# EAGLE design PiKVM_ATX_Adapter v1.5 (EAGLE 9.6.2)
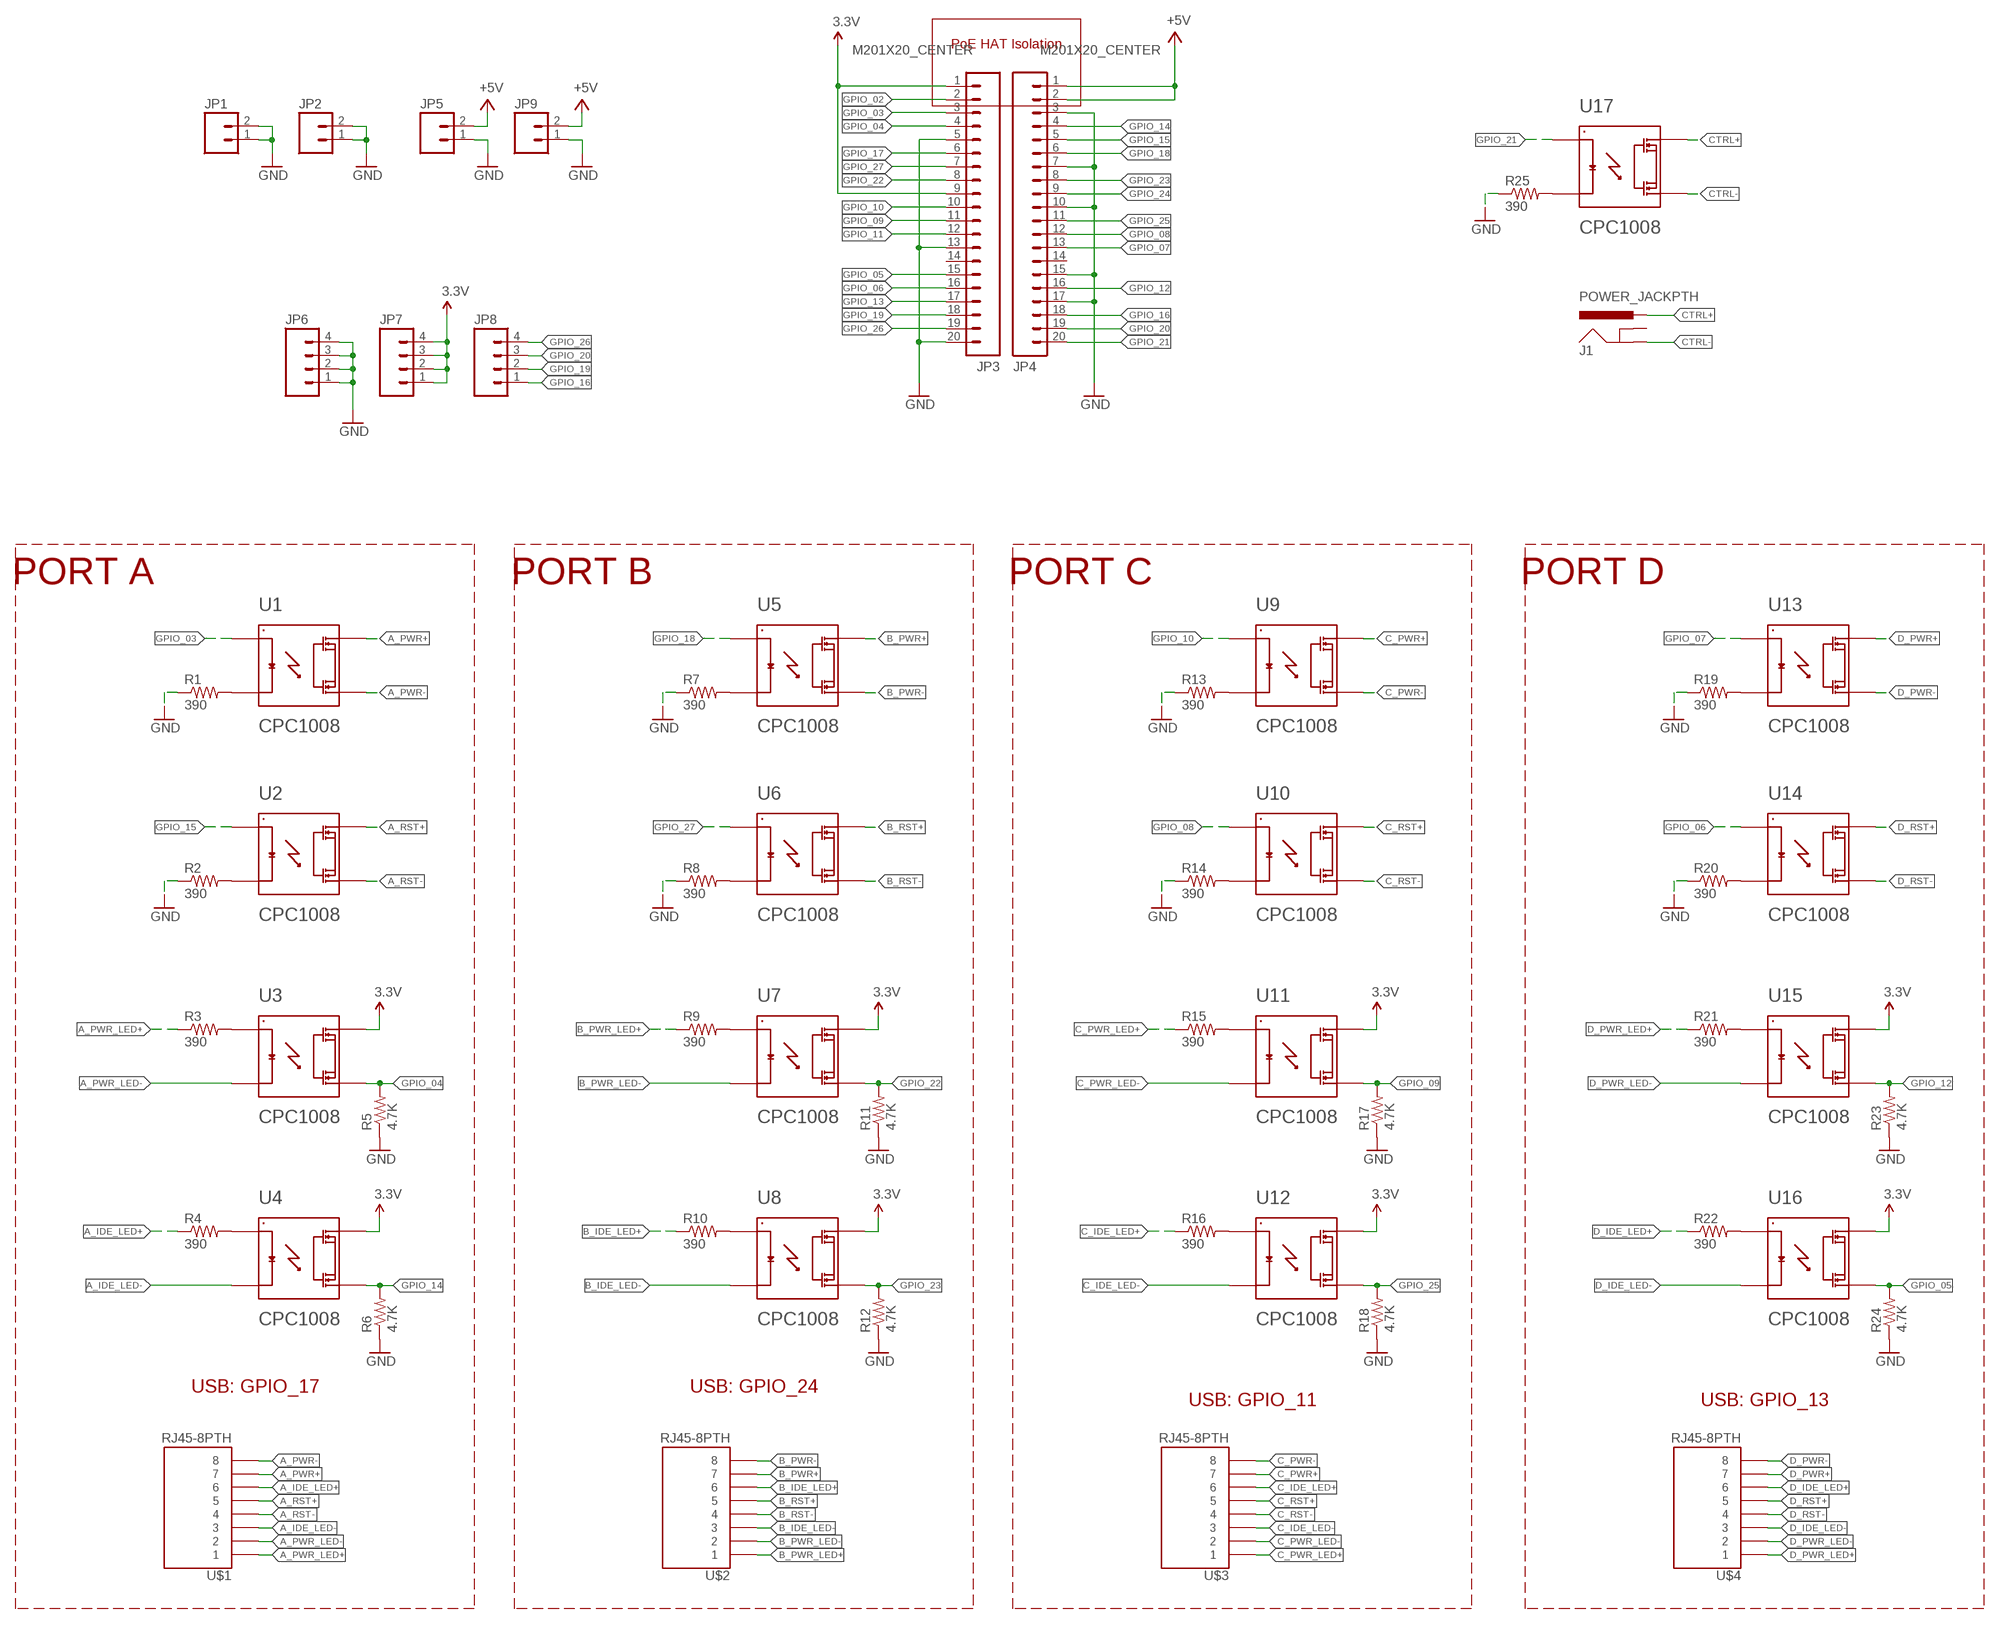
[diagram p0: schematic, sheet 1]

## Parts
J1  POWER_JACKPTH  [POWER_JACK_PTH]
JP1  M02LOCK  [1X02_LOCK]
JP2  M02LOCK  [1X02_LOCK]
JP3  M201X20_CENTER  [1X20_CENTER]
JP4  M201X20_CENTER  [1X20_CENTER]
JP5  M02LOCK  [1X02_LOCK]
JP6  M04PTH  [1X04]
JP7  M04PTH  [1X04]
JP8  M04PTH  [1X04]
JP9  M02LOCK  [1X02_LOCK]
R1  390  RESISTOR1206  [1206]
R2  390  RESISTOR1206  [1206]
R3  390  RESISTOR1206  [1206]
R4  390  RESISTOR1206  [1206]
R5  4.7K  RESISTOR1206  [1206]
R6  4.7K  RESISTOR1206  [1206]
R7  390  RESISTOR1206  [1206]
R8  390  RESISTOR1206  [1206]
R9  390  RESISTOR1206  [1206]
R10  390  RESISTOR1206  [1206]
R11  4.7K  RESISTOR1206  [1206]
R12  4.7K  RESISTOR1206  [1206]
R13  390  RESISTOR1206  [1206]
R14  390  RESISTOR1206  [1206]
R15  390  RESISTOR1206  [1206]
R16  390  RESISTOR1206  [1206]
R17  4.7K  RESISTOR1206  [1206]
R18  4.7K  RESISTOR1206  [1206]
R19  390  RESISTOR1206  [1206]
R20  390  RESISTOR1206  [1206]
R21  390  RESISTOR1206  [1206]
R22  390  RESISTOR1206  [1206]
R23  4.7K  RESISTOR1206  [1206]
R24  4.7K  RESISTOR1206  [1206]
R25  390  RESISTOR1206  [1206]
U1  CPC1008  [SOP-4]
U2  CPC1008  [SOP-4]
U3  CPC1008  [SOP-4]
U4  CPC1008  [SOP-4]
U5  CPC1008  [SOP-4]
U6  CPC1008  [SOP-4]
U7  CPC1008  [SOP-4]
U8  CPC1008  [SOP-4]
U9  CPC1008  [SOP-4]
U10  CPC1008  [SOP-4]
U11  CPC1008  [SOP-4]
U12  CPC1008  [SOP-4]
U13  CPC1008  [SOP-4]
U14  CPC1008  [SOP-4]
U15  CPC1008  [SOP-4]
U16  CPC1008  [SOP-4]
U17  CPC1008  [SOP-4]
U$1  RJ45-8PTH  [RJ45-8]
U$2  RJ45-8PTH  [RJ45-8]
U$3  RJ45-8PTH  [RJ45-8]
U$4  RJ45-8PTH  [RJ45-8]

## Nets
3.3V: JP3.1 JP3.9 JP7.1 JP7.2 JP7.3 JP7.4 U3.P$4 U4.P$4 U7.P$4 U8.P$4 U11.P$4 U12.P$4 U15.P$4 U16.P$4
+5V: JP4.1 JP4.2 JP5.2 JP9.2
A_IDE_LED+: R4.1 U$1.6
A_IDE_LED-: U4.P$2 U$1.3
A_PWR+: U1.P$4 U$1.7
A_PWR-: U1.P$3 U$1.8
A_PWR_LED+: R3.1 U$1.1
A_PWR_LED-: U3.P$2 U$1.2
A_RST+: U2.P$4 U$1.5
A_RST-: U2.P$3 U$1.4
B_IDE_LED+: R10.1 U$2.6
B_IDE_LED-: U8.P$2 U$2.3
B_PWR+: U5.P$4 U$2.7
B_PWR-: U5.P$3 U$2.8
B_PWR_LED+: R9.1 U$2.1
B_PWR_LED-: U7.P$2 U$2.2
B_RST+: U6.P$4 U$2.5
B_RST-: U6.P$3 U$2.4
C_IDE_LED+: R16.1 U$3.6
C_IDE_LED-: U12.P$2 U$3.3
C_PWR+: U9.P$4 U$3.7
C_PWR-: U9.P$3 U$3.8
C_PWR_LED+: R15.1 U$3.1
C_PWR_LED-: U11.P$2 U$3.2
C_RST+: U10.P$4 U$3.5
C_RST-: U10.P$3 U$3.4
CTRL+: J1.PWR U17.P$4
CTRL-: J1.GND U17.P$3
D_IDE_LED+: R22.1 U$4.6
D_IDE_LED-: U16.P$2 U$4.3
D_PWR+: U13.P$4 U$4.7
D_PWR-: U13.P$3 U$4.8
D_PWR_LED+: R21.1 U$4.1
D_PWR_LED-: U15.P$2 U$4.2
D_RST+: U14.P$4 U$4.5
D_RST-: U14.P$3 U$4.4
GND: JP1.1 JP1.2 JP2.1 JP2.2 JP3.5 JP3.13 JP3.20 JP4.3 JP4.7 JP4.10 JP4.15 JP4.17 JP5.1 JP6.1 JP6.2 JP6.3 JP6.4 JP9.1 R1.1 R2.1 R5.1 R6.1 R7.1 R8.1 R11.1 R12.1 R13.1 R14.1 R17.1 R18.1 R19.1 R20.1 R23.1 R24.1 R25.1
GPIO_02: JP3.2
GPIO_03: JP3.3 U1.P$1
GPIO_04: JP3.4 R5.2 U3.P$3
GPIO_05: JP3.15 R24.2 U16.P$3
GPIO_06: JP3.16 U14.P$1
GPIO_07: JP4.13 U13.P$1
GPIO_08: JP4.12 U10.P$1
GPIO_09: JP3.11 R17.2 U11.P$3
GPIO_10: JP3.10 U9.P$1
GPIO_11: JP3.12
GPIO_12: JP4.16 R23.2 U15.P$3
GPIO_13: JP3.17
GPIO_14: JP4.4 R6.2 U4.P$3
GPIO_15: JP4.5 U2.P$1
GPIO_16: JP4.18 JP8.1
GPIO_17: JP3.6
GPIO_18: JP4.6 U5.P$1
GPIO_19: JP3.18 JP8.2
GPIO_20: JP4.19 JP8.3
GPIO_21: JP4.20 U17.P$1
GPIO_22: JP3.8 R11.2 U7.P$3
GPIO_23: JP4.8 R12.2 U8.P$3
GPIO_24: JP4.9
GPIO_25: JP4.11 R18.2 U12.P$3
GPIO_26: JP3.19 JP8.4
GPIO_27: JP3.7 U6.P$1
N$1: R2.2 U2.P$2
N$2: R3.2 U3.P$1
N$3: R7.2 U5.P$2
N$4: R1.2 U1.P$2
N$5: R4.2 U4.P$1
N$6: R8.2 U6.P$2
N$7: R9.2 U7.P$1
N$8: R10.2 U8.P$1
N$9: R13.2 U9.P$2
N$10: R14.2 U10.P$2
N$11: R15.2 U11.P$1
N$12: R16.2 U12.P$1
N$13: R19.2 U13.P$2
N$14: R20.2 U14.P$2
N$15: R21.2 U15.P$1
N$16: R22.2 U16.P$1
N$17: R25.2 U17.P$2
Unconnected: J1.GNDBREAK JP3.14 JP4.14

## Notes on the sheet
- PoE HAT Isolation
- PORT A | PORT B | PORT C | PORT D
- USB: GPIO_17 | USB: GPIO_24
- USB: GPIO_11 | USB: GPIO_13

## Library data of the parts
J1 = SparkFun-Connectors:POWER_JACK: Power Jack This is the standard 5.5mm barrel jack for power. The PTH is the most common, proven, reliable, footprint. The Slot footprint only works if the mill layer is transmitted to the PCB fab house so be warned. Spark Fun Electronics SKU : PRT-00119 SMT: CONN-08106 Mating wall wart : TOL-00298 (and others)
JP1 JP2 JP5 JP9 = SparkFun-Connectors:M02: Header 2 Standard 2-pin 0.1" header. Use with straight break away headers (SKU : PRT-00116), right angle break away headers (PRT-00553), swiss pins (PRT-00743), machine pins (PRT-00117), and female headers (PRT-00115). Molex polarized connector foot print use with SKU : PRT-08233 with associated crimp pins and housings.
JP3 JP4 = SparkFun-Connectors:M20: 1x20 .1" header This is just like the LOCK variant in that the holes are staggared by 5 mil, but except for the last two holes. They are not altered from the "standard" footprint layout. This is used for a special purpose on the layout of our Graphic LCD Backpack. Make sure you want to use this device before selecting it for you project!
JP6-JP8 = SparkFun-Connectors:M04: Header 4 Standard 4-pin 0.1" header. Use with straight break away headers (SKU : PRT-00116), right angle break away headers (PRT-00553), swiss pins (PRT-00743), machine pins (PRT-00117), and female headers (PRT-00115). Molex polarized connector foot print use with SKU : PRT-08231 with associated crimp pins and housings. 1MM SMD Version SKU: PRT-10208
R1-R25 = SparkFun-Resistors:RESISTOR: Resistor Basic schematic elements and footprints for 0603, 1206, and PTH resistors.
U1-U17 = MyLib2:CPC1008
U$1-U$4 = SparkFun-Connectors:RJ45-8: RJ45 Jack Simple RJ45, 8-pin connection - connector for common Cat5, Cat5e, and Cat6 Ethernet cables. Footprint not yet proven in production. Connector sku is PRT-00643; Breakout PCB sku is BOB-00716.

## Board
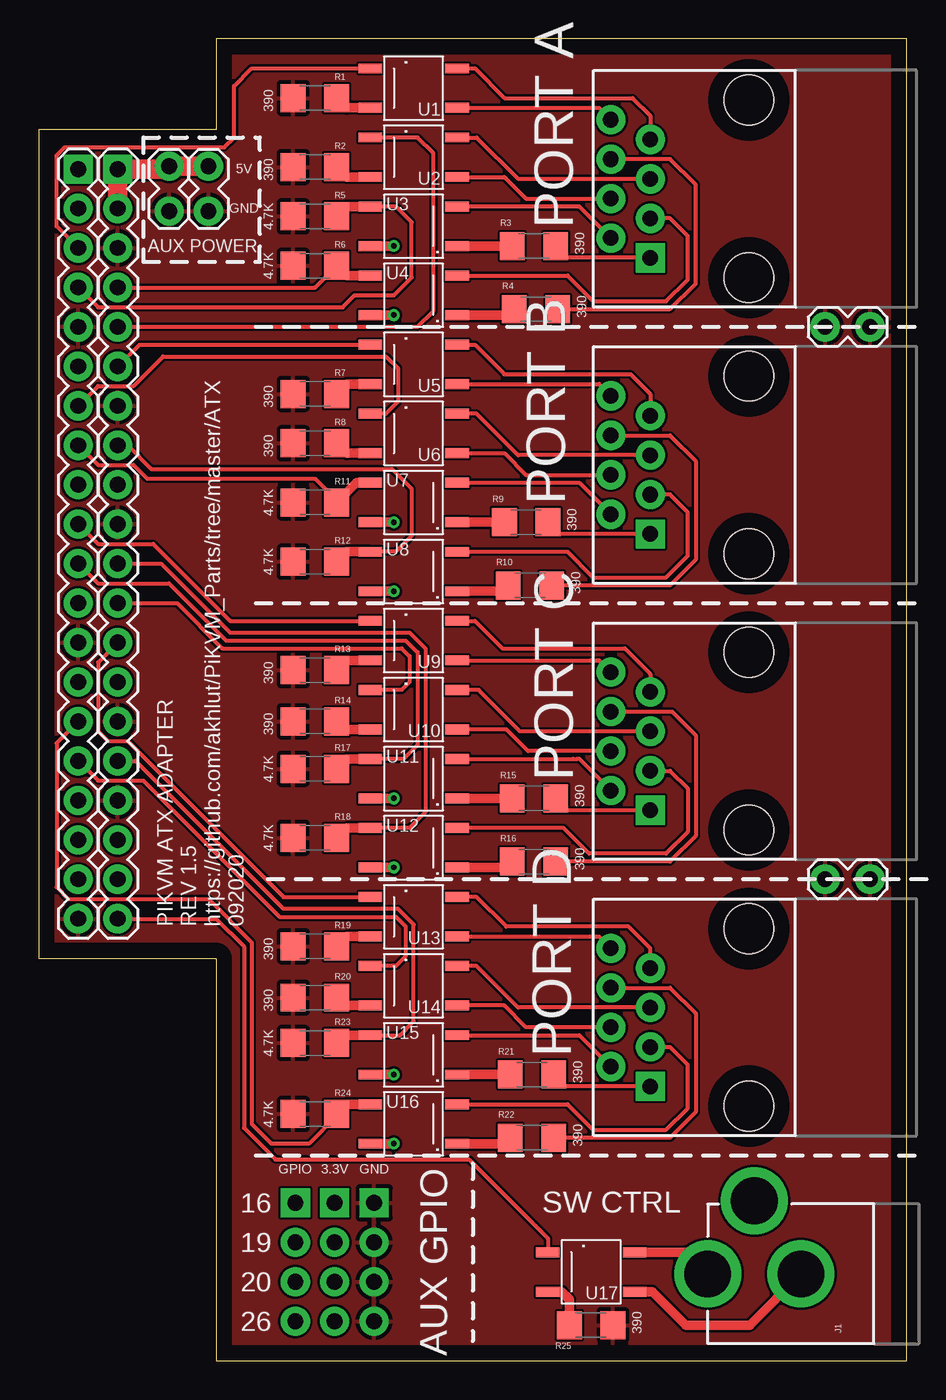
[diagram p1: board, top side]
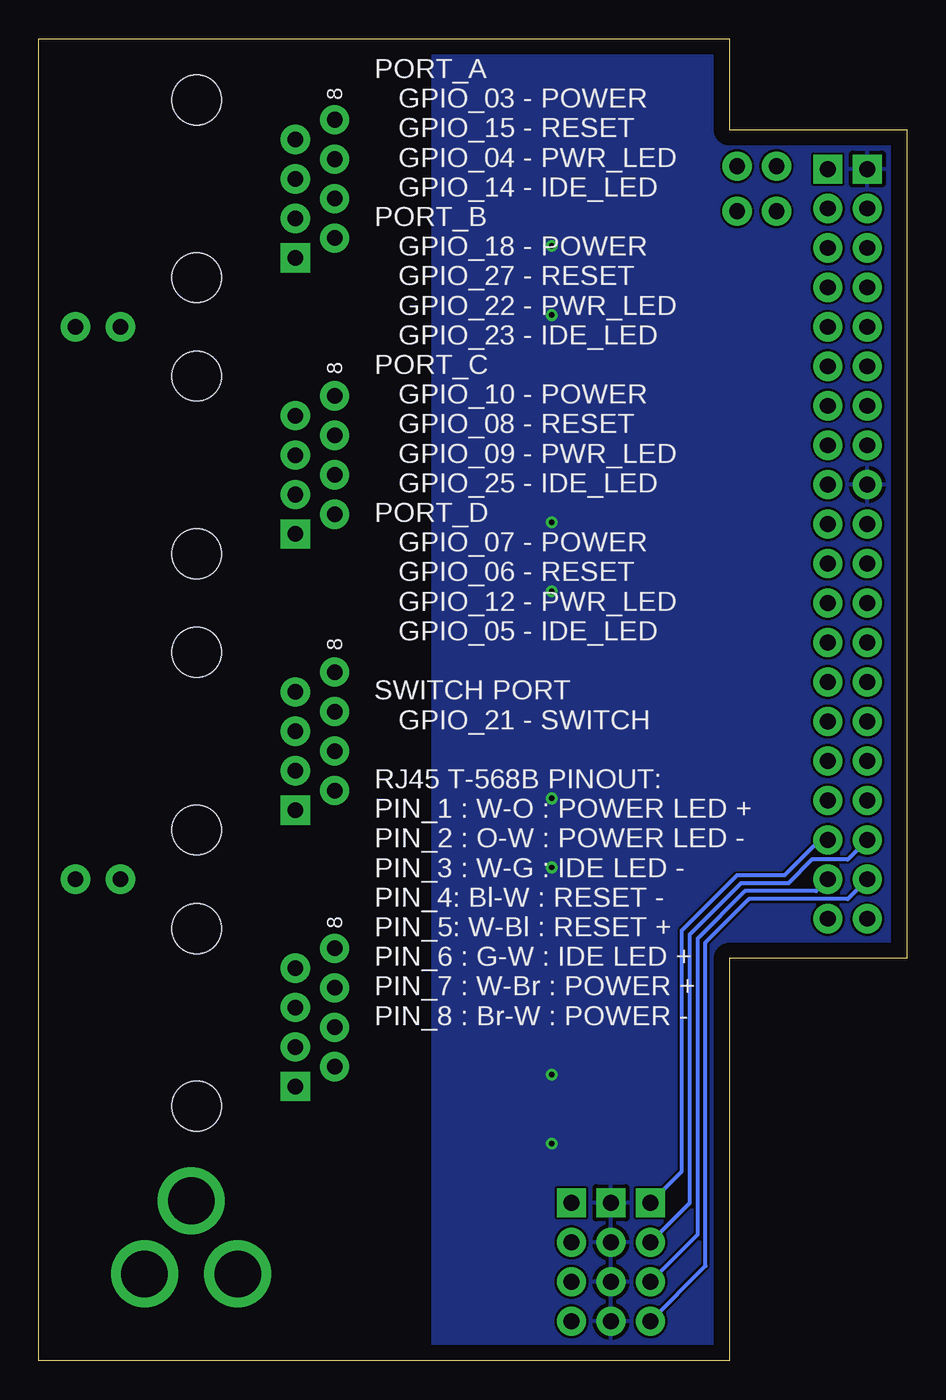
[diagram p2: board, bottom side, seen from below]

Size 55.88 x 85.09 mm. Coordinates in mm from the lower left corner, seen from the top.
Outline: 11.43,0 55.88,0 55.88,85.09 11.43,85.09 11.43,79.25 0,79.25 0,25.91 11.43,25.91 11.43,0
Copper layers (1*16): Top 0.035mm / dielectric 1.5mm / Bottom 0.035mm
Design rules "default": minimum track width 6mil, minimum drill 0.35mm, track to track 6mil, track to pad 6mil, pad to pad 6mil, via to via 6mil, smd to smd 6mil, copper to edge 40mil, drill to drill 6mil, minimum pad ring 10mil, minimum via ring 8mil, stop-mask expansion 4mil, vias tented up to drill 0mil, thermal gap 10mil

### Footprints (pad centres in the part's own frame; a part is rotated, then mirrored left to right if it is on the bottom)
POWER_JACK_PTH = drill 2.997 pad 4.318: GND 0,7.7; GNDBREAK 4.7,10.7; PWR 0,13.7
1X02_LOCK = drill 1.016 pad 1.88: 1 -0.178,0; 2 2.718,0
1X20_CENTER = drill 1.016 pad 1.88 square: 1 -24.13,0 | drill 1.016 pad 1.88: 2 -21.59,0; 3 -19.05,0; 4 -16.51,0; 5 -13.97,0; 6 -11.43,0; 7 -8.89,0; 8 -6.35,0; 9 -3.81,0; 10 -1.27,0; 11 1.27,0; 12 3.81,0; 13 6.35,0; 14 8.89,0; 15 11.43,0; 16 13.97,0; 17 16.51,0; 18 19.05,0; 19 21.59,0; 20 24.13,0
1X04 = drill 1.016 pad 1.88 square: 1 -3.81,0 | drill 1.016 pad 1.88: 2 -1.27,0; 3 1.27,0; 4 3.81,0
1206 = smd 1.6 x 1.8: 1 -1.4,0; 2 1.4,0
SOP-4 = smd 0.635 x 1.524: P$1 -1.27,-2.794; P$2 1.27,-2.794; P$3 1.27,2.794; P$4 -1.27,2.794
RJ45-8 = drill 1 pad 1.88 square: 1 -4.445,6.35 | drill 1 pad 1.88: 2 -3.175,8.89; 3 -1.905,6.35; 4 -0.635,8.89; 5 0.635,6.35; 6 1.905,8.89; 7 3.175,6.35; 8 4.445,8.89 | hole 3.2: -5.715,0; 5.715,0

### Placement (x,y rotation side)
J1  56.77,5.59 90 top
JP1  50.8,66.55 0 top
JP2  50.8,30.99 0 top
JP3  2.54,52.58 270 top
JP4  5.08,52.58 270 top
JP5  8.38,74.17 90 top
JP6  21.59,6.35 270 top
JP7  19.05,6.35 270 top
JP8  16.51,6.35 270 top
JP9  10.92,74.17 90 top
R1  17.78,81.28 0 top
R2  17.78,76.83 0 top
R3  31.88,71.75 180 top
R4  32,67.69 180 top
R5  17.78,73.66 0 top
R6  17.78,70.48 0 top
R7  17.78,62.23 0 top
R8  17.78,59.05 0 top
R9  31.37,53.98 180 top
R10  31.62,49.91 180 top
R11  17.78,55.24 0 top
R12  17.78,51.44 0 top
R13  17.78,44.45 0 top
R14  17.78,41.15 0 top
R15  31.88,36.2 180 top
R16  31.88,32.13 180 top
R17  17.78,38.1 0 top
R18  17.78,33.66 0 top
R19  17.78,26.67 0 top
R20  17.78,23.37 0 top
R21  31.75,18.41 180 top
R22  31.75,14.35 180 top
R23  17.78,20.45 0 top
R24  17.78,15.88 0 top
R25  35.56,2.29 180 top
U1  24.13,81.92 270 top
U2  24.13,77.47 270 top
U3  24.13,73.03 90 top
U4  24.13,68.58 90 top
U5  24.13,64.14 270 top
U6  24.13,59.69 270 top
U7  24.13,55.24 90 top
U8  24.13,50.8 90 top
U9  24.13,46.35 270 top
U10  24.13,41.91 270 top
U11  24.13,37.47 90 top
U12  24.13,33.02 90 top
U13  24.13,28.57 270 top
U14  24.13,24.13 270 top
U15  24.13,19.68 90 top
U16  24.13,15.24 90 top
U17  35.56,5.71 270 top
U$1  45.72,75.44 90 top
U$2  45.72,57.66 90 top
U$3  45.72,39.88 90 top
U$4  45.72,22.1 90 top

### Tracks (layer width: path | path; a pad name or v marks a point on that pad's centre or on a via)
3.3V  (via drill 0.35)
  Top 0.61: U15.P$4 v22.86,18.41 | U16.P$4 v22.86,13.97 | U12.P$4 v22.86,31.75 | U11.P$4 v22.86,36.2 | U8.P$4 v22.86,49.53 | U7.P$4 v22.86,53.98 | U4.P$4 v22.86,67.31 | U3.P$4 v22.86,71.75
  pour Bottom: 0,85.09 0,0 30.48,0 30.48,85.09
+5V
  Top 1.27: JP9.2 JP5.2 8.2,76.71 JP4.1 JP4.2
A_IDE_LED+
  Top 0.254: U$1.6 40.64,77.34 42.29,75.69 42.29,69.34 40.64,67.69 R4.1
A_IDE_LED-
  Top 0.254: U4.P$2 34.04,69.85 35.69,68.2 40.39,68.2 41.78,69.6 41.78,72.39 40.64,73.53 U$1.3
A_PWR+
  Top 0.254: U1.P$4 28.07,83.19 29.97,81.28 38.23,81.28 39.37,80.14 U$1.7
A_PWR-
  Top 0.254: U1.P$3 36.07,80.64 U$1.8
A_PWR_LED+
  Top 0.254: R3.1 34.04,70.99 U$1.1
A_PWR_LED-
  Top 0.254: U$1.2 34.8,74.3 U3.P$2
A_RST+
  Top 0.254: U2.P$4 28.19,78.74 30.86,76.07 U$1.5
A_RST-
  Top 0.254: U2.P$3 29.97,76.2 31.37,74.8 U$1.4
B_IDE_LED+
  Top 0.254: R10.1 40.64,49.91 42.29,51.56 42.29,57.91 40.64,59.56 U$2.6
B_IDE_LED-
  Top 0.254: U8.P$2 34.04,52.07 35.69,50.42 40.39,50.42 41.78,51.82 41.78,54.61 40.64,55.75 U$2.3
B_PWR+
  Top 0.254: U5.P$4 28.07,65.41 29.97,63.5 38.1,63.5 39.37,62.23 U$2.7
B_PWR-
  Top 0.254: U5.P$3 36.07,62.87 U$2.8
B_PWR_LED+
  Top 0.254: U$2.1 33.15,53.21 32.77,53.59 R9.1
B_PWR_LED-
  Top 0.254: U7.P$2 34.8,56.52 U$2.2
B_RST+
  Top 0.254: U$2.5 30.86,58.29 28.19,60.96 U6.P$4
B_RST-
  Top 0.254: U6.P$3 29.97,58.42 31.37,57.02 U$2.4
C_IDE_LED+
  Top 0.254: R16.1 40.64,32.13 42.29,33.78 42.29,40.26 40.77,41.78 U$3.6
C_IDE_LED-
  Top 0.254: U12.P$2 33.78,34.29 35.43,32.64 40.39,32.64 41.78,34.04 41.78,36.83 40.64,37.97 U$3.3
C_PWR+
  Top 0.254: U9.P$4 28.07,47.62 29.84,45.85 37.72,45.85 39.37,44.2 U$3.7
C_PWR-
  Top 0.254: U9.P$3 35.56,45.09 35.94,45.09 36.07,45.09 U$3.8
C_PWR_LED+
  Top 0.254: R15.1 33.28,35.94 | 33.28,35.94 33.28,35.82 33.02,35.56 | U$3.1 33.78,35.43 33.28,35.94
C_PWR_LED-
  Top 0.254: U11.P$2 34.42,38.73 34.67,38.73 34.8,38.73 U$3.2
C_RST+
  Top 0.254: U10.P$4 28.32,43.18 30.99,40.51 U$3.5
C_RST-
  Top 0.254: U10.P$3 30.1,40.64 31.5,39.24 U$3.4
CTRL+
  Top 0.254: 43.05,5.59 J1.PWR
  Top 0.61: U17.P$4 41.66,6.99 43.05,5.59
CTRL-
  Top 0.61: U17.P$3 39.5,4.45 41.66,2.29 45.77,2.29 J1.GND
D_IDE_LED+
  Top 0.254: R22.1 40.64,14.35 42.29,16 42.29,22.35 40.64,24 U$4.6
D_IDE_LED-
  Top 0.254: U$4.3 40.64,20.19 41.78,19.05 41.78,16.26 40.39,14.86 35.69,14.86 34.04,16.51 U16.P$2
D_PWR+
  Top 0.254: U$4.7 39.37,26.54 37.97,27.94 30.1,27.94 28.19,29.84 U13.P$4
D_PWR-
  Top 0.254: U13.P$3 36.07,27.3 U$4.8
D_PWR_LED+
  Top 0.254: U$4.1 33.91,17.65 R21.1
D_PWR_LED-
  Top 0.254: U15.P$2 34.8,20.95 U$4.2
D_RST+
  Top 0.254: U$4.5 30.86,22.73 28.19,25.4 U14.P$4
D_RST-
  Top 0.254: U$4.4 31.37,21.46 29.97,22.86 U14.P$3
GND
  pour Top: 0,85.09 0,0 55.88,0 55.88,85.09
GPIO_03
  Top 0.254: JP3.3 1.14,73.03 1.14,77.59 1.66,78.11 11.94,78.11 12.57,78.74 12.57,82.04 13.72,83.19 U1.P$1
GPIO_04
  Top 0.254: JP3.4 3.81,67.82 19.56,67.82 20.32,68.58 22.86,68.58 24,69.72 24,73.28 22.99,74.3 U3.P$3
  Top 0.61: U3.P$3 19.82,74.3 R5.2
GPIO_05
  Top 0.254: JP3.15 1.14,39.75 1.14,30.48 1.91,29.72 10.92,29.72 13.72,26.92 13.72,15.24 14.99,13.97 17.4,13.97 19.18,15.75 R24.2
  Top 0.61: U16.P$3 19.82,16.51 R24.2
GPIO_06
  Top 0.254: JP3.16 3.81,37.34 6.73,37.34 15.49,28.57 22.99,28.57 23.62,27.94 23.62,26.04 22.99,25.4 U14.P$1
GPIO_07
  Top 0.254: U13.P$1 15.75,29.84 5.71,39.88 4.45,39.88 3.81,40.51 3.81,44.96 JP4.13
GPIO_08
  Top 0.254: JP4.12 8.89,48.77 11.81,45.85 23.37,45.85 23.88,45.34 23.88,43.69 23.37,43.18 U10.P$1
GPIO_09
  Top 0.254: JP3.11 3.81,50.04 8.38,50.04 12.06,46.35 23.62,46.35 24.38,45.59 24.38,39.62 23.5,38.73 U11.P$3
  Top 0.61: U11.P$3 19.82,38.73 R17.2
GPIO_10
  Top 0.254: JP3.10 3.81,52.58 7.37,52.58 12.32,47.62 U9.P$1
GPIO_12
  Top 0.254: JP4.16 6.22,38.61 15.75,29.08 23.11,29.08 24.13,28.07 24.13,21.84 23.24,20.95 U15.P$3
  Top 0.61: U15.P$3 19.69,20.95 R23.2
GPIO_14
  Top 0.254: JP4.4 17.78,69.09 R6.2
  Top 0.61: U4.P$3 19.82,69.85 R6.2
GPIO_15
  Top 0.254: U2.P$1 24.38,78.74 25.4,77.72 25.4,67.56 24.38,66.55 JP4.5
GPIO_16
  Bottom 0.254: JP4.18 5.59,33.53 7.87,31.24 10.92,31.24 14.48,27.69 14.48,12.19 JP8.1
GPIO_18
  Top 0.254: JP4.6 6.48,65.41 U5.P$1
GPIO_19
  Bottom 0.254: JP3.18 3.81,32.26 6.1,32.26 7.62,30.73 10.67,30.73 13.97,27.43 13.97,10.16 JP8.2
GPIO_20
  Bottom 0.254: JP4.19 5.84,30.23 10.41,30.23 13.46,27.18 13.46,8.13 JP8.3
GPIO_21
  Top 0.254: JP4.20 11.43,28.45 13.21,26.67 13.21,14.99 15.24,12.95 27.69,12.95 32.77,7.87 U17.P$1
GPIO_22
  Top 0.254: JP3.8 3.81,57.66 6.1,57.66 6.99,56.77 17.78,56.77 19.18,55.37 R11.2
  Top 0.61: U7.P$3 20.45,56.52 R11.2
GPIO_23
  Top 0.254: JP4.8 5.71,58.93 7.24,57.4 22.73,57.4 24,56.13 24,53.09 22.99,52.07 U8.P$3
  Top 0.61: U8.P$3 19.82,52.07 R12.2
GPIO_25
  Top 0.254: JP4.11 7.87,51.31 12.32,46.86 23.88,46.86 24.89,45.85 24.89,35.31 23.88,34.29 U12.P$3
  Top 0.61: U12.P$3 19.82,34.29 R18.2
GPIO_26
  Bottom 0.254: JP3.19 3.81,29.72 10.16,29.72 12.95,26.92 12.95,6.1 JP8.4
GPIO_27
  Top 0.254: JP3.7 3.81,62.74 6.1,62.74 8,64.64 22.35,64.64 23.11,63.88 23.11,61.72 22.35,60.96 U6.P$1
N$1
  Top 0.61: U2.P$2 19.82,76.2 R2.2
N$2
  Top 0.61: U3.P$1 R3.2
N$3
  Top 0.61: U5.P$2 19.82,62.87 R7.2
N$4
  Top 0.61: U1.P$2 19.82,80.64 R1.2
N$5
  Top 0.254: 30.22,67.31 R4.2
  Top 0.61: U4.P$1 30.22,67.31
N$6
  Top 0.61: U6.P$2 19.82,58.42 R8.2
N$7
  Top 0.61: U7.P$1 R9.2
N$8
  Top 0.254: 29.84,49.53 R10.2
  Top 0.61: U8.P$1 29.84,49.53
N$9
  Top 0.61: U9.P$2 19.82,45.09 R13.2
N$10
  Top 0.61: U10.P$2 19.69,40.64 R14.2
N$11
  Top 0.61: U11.P$1 R15.2
N$12
  Top 0.254: 30.1,31.75 R16.2
  Top 0.61: U12.P$1 30.1,31.75
N$13
  Top 0.61: U13.P$2 19.82,27.3 R19.2
N$14
  Top 0.61: U14.P$2 19.69,22.86 R20.2
N$15
  Top 0.61: U15.P$1 R21.2
N$16
  Top 0.254: 29.97,13.97 R22.2
  Top 0.61: U16.P$1 29.97,13.97
N$17
  Top 0.61: R25.2 34.16,3.94 33.66,4.45 U17.P$2

### Text on the board
tNames: 5V | GND | PORT A | AUX POWER | PORT B | PORT C | PIKVM ATX ADAPTER / REV 1.5 / https://github.com/akhlut/PiKVM_Parts/tree/master/ATX / 092020 | PORT D | GPIO | 3.3V | GND | 16 | SW CTRL | 19 | AUX GPIO | 20 | 26
bNames: PORT_A / GPIO_03 - POWER / GPIO_15 - RESET / GPIO_04 - PWR_LED / GPIO_14 - IDE_LED / PORT_B / GPIO_18 - POWER / GPIO_27 - RESET / GPIO_22 - PWR_LED / GPIO_23 - IDE_LED / PORT_C / GPIO_10 - POWER / GPIO_08 - RESET / GPIO_09 - PWR_LED / GPIO_25 - IDE_LED / PORT_D / GPIO_07 - POWER / GPIO_06 - RESET / GPIO_12 - PWR_LED / GPIO_05 - IDE_LED / / SWITCH PORT / GPIO_21 - SWITCH | 8 | 8 | 8 | RJ45 T-568B PINOUT: / PIN_1 : W-O : POWER LED + / PIN_2 : O-W : POWER LED - / PIN_3 : W-G : IDE LED - / PIN_4: Bl-W : RESET - / PIN_5: W-Bl : RESET + / PIN_6 : G-W : IDE LED + / PIN_7 : W-Br : POWER + / PIN_8 : Br-W : POWER - | 8